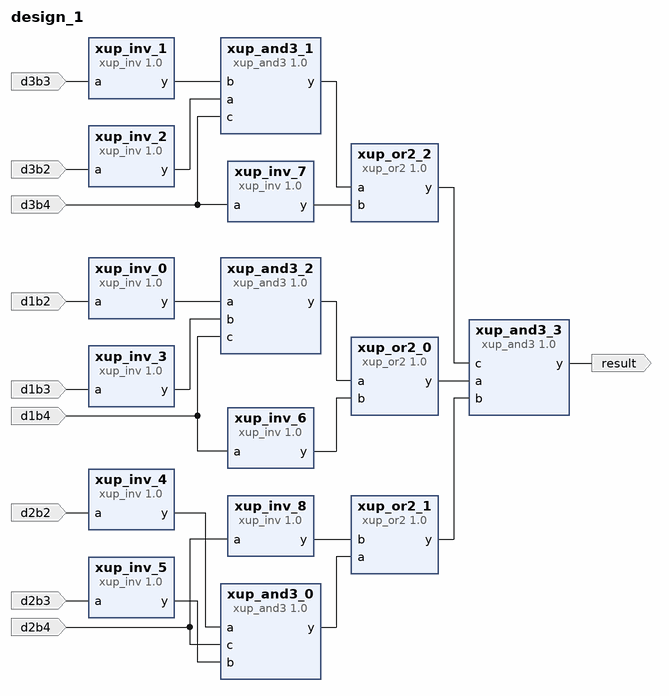
[diagram p0: block diagram of the top level]
# Vivado block design design_1, xc7a35tcpg236-1, Vivado 2018.2
create_bd_design design_1

create_bd_port -dir I d1b2
create_bd_port -dir I d1b3
create_bd_port -dir I d1b4
create_bd_port -dir I d2b2
create_bd_port -dir I d2b3
create_bd_port -dir I d2b4
create_bd_port -dir I d3b2
create_bd_port -dir I d3b3
create_bd_port -dir I d3b4
create_bd_port -dir O result

create_bd_cell -type ip -vlnv xilinx.com:XUP:xup_and3:1.0 xup_and3_0
create_bd_cell -type ip -vlnv xilinx.com:XUP:xup_and3:1.0 xup_and3_1
create_bd_cell -type ip -vlnv xilinx.com:XUP:xup_and3:1.0 xup_and3_2
create_bd_cell -type ip -vlnv xilinx.com:XUP:xup_inv:1.0 xup_inv_0
create_bd_cell -type ip -vlnv xilinx.com:XUP:xup_inv:1.0 xup_inv_1
create_bd_cell -type ip -vlnv xilinx.com:XUP:xup_inv:1.0 xup_inv_2
create_bd_cell -type ip -vlnv xilinx.com:XUP:xup_inv:1.0 xup_inv_3
create_bd_cell -type ip -vlnv xilinx.com:XUP:xup_inv:1.0 xup_inv_4
create_bd_cell -type ip -vlnv xilinx.com:XUP:xup_inv:1.0 xup_inv_5
create_bd_cell -type ip -vlnv xilinx.com:XUP:xup_or2:1.0 xup_or2_0
create_bd_cell -type ip -vlnv xilinx.com:XUP:xup_or2:1.0 xup_or2_1
create_bd_cell -type ip -vlnv xilinx.com:XUP:xup_or2:1.0 xup_or2_2
create_bd_cell -type ip -vlnv xilinx.com:XUP:xup_inv:1.0 xup_inv_6
create_bd_cell -type ip -vlnv xilinx.com:XUP:xup_inv:1.0 xup_inv_7
create_bd_cell -type ip -vlnv xilinx.com:XUP:xup_inv:1.0 xup_inv_8
create_bd_cell -type ip -vlnv xilinx.com:XUP:xup_and3:1.0 xup_and3_3

# ---- connections ----

connect_bd_net -net d1b4_1 [get_bd_ports d1b4] [get_bd_pins xup_and3_2/c] [get_bd_pins xup_inv_6/a]
connect_bd_net -net d2b4_1 [get_bd_ports d2b4] [get_bd_pins xup_and3_0/c] [get_bd_pins xup_inv_8/a]
connect_bd_net -net d3b4_1 [get_bd_ports d3b4] [get_bd_pins xup_and3_1/c] [get_bd_pins xup_inv_7/a]
connect_bd_net -net d1b2_1 [get_bd_ports d1b2] [get_bd_pins xup_inv_0/a]
connect_bd_net -net d1b3_1 [get_bd_ports d1b3] [get_bd_pins xup_inv_3/a]
connect_bd_net [get_bd_pins xup_inv_0/y] [get_bd_pins xup_and3_2/a]
connect_bd_net [get_bd_pins xup_inv_3/y] [get_bd_pins xup_and3_2/b]
connect_bd_net -net d2b2_1 [get_bd_ports d2b2] [get_bd_pins xup_inv_4/a]
connect_bd_net -net d2b3_1 [get_bd_ports d2b3] [get_bd_pins xup_inv_5/a]
connect_bd_net [get_bd_pins xup_inv_4/y] [get_bd_pins xup_and3_0/a]
connect_bd_net [get_bd_pins xup_inv_5/y] [get_bd_pins xup_and3_0/b]
connect_bd_net -net d3b2_1 [get_bd_ports d3b2] [get_bd_pins xup_inv_2/a]
connect_bd_net -net d3b3_1 [get_bd_ports d3b3] [get_bd_pins xup_inv_1/a]
connect_bd_net [get_bd_pins xup_inv_2/y] [get_bd_pins xup_and3_1/a]
connect_bd_net [get_bd_pins xup_inv_1/y] [get_bd_pins xup_and3_1/b]
connect_bd_net [get_bd_pins xup_and3_2/y] [get_bd_pins xup_or2_0/a]
connect_bd_net [get_bd_pins xup_inv_6/y] [get_bd_pins xup_or2_0/b]
connect_bd_net [get_bd_pins xup_and3_0/y] [get_bd_pins xup_or2_1/a]
connect_bd_net [get_bd_pins xup_inv_8/y] [get_bd_pins xup_or2_1/b]
connect_bd_net [get_bd_pins xup_and3_1/y] [get_bd_pins xup_or2_2/a]
connect_bd_net [get_bd_pins xup_inv_7/y] [get_bd_pins xup_or2_2/b]
connect_bd_net [get_bd_pins xup_or2_0/y] [get_bd_pins xup_and3_3/a]
connect_bd_net [get_bd_pins xup_or2_1/y] [get_bd_pins xup_and3_3/b]
connect_bd_net [get_bd_pins xup_or2_2/y] [get_bd_pins xup_and3_3/c]
connect_bd_net [get_bd_pins xup_and3_3/y] [get_bd_ports result]

validate_bd_design
save_bd_design
